# Altium schematic sheet Sheet1.SchDoc
size A
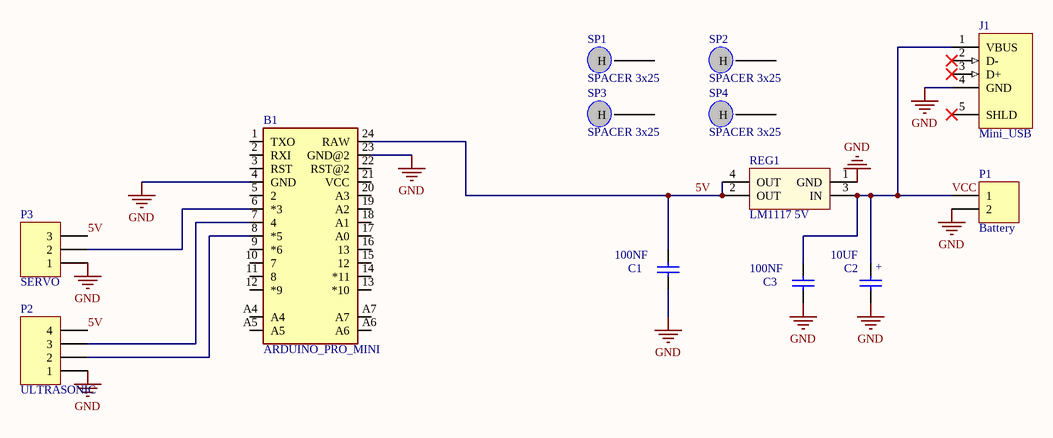
[diagram p0: Sheet1.SchDoc]

## Parts
B1  ARDUINO_PRO_MINI  [ARDUINO_PRO_MINI]
C1  100NF  [MY_CAP_CERAMIC]
C2  10UF  [MY_CAP_POL 4MM]
C3  100NF  [MY_CAP_CERAMIC]
J1  Mini_USB  [My_USB]
P1  Battery  [My_1X02]
P2  ULTRASONIC  [My_1X04]
P3  SERVO  [My_1X03]
REG1  LM1117 5V  [MY_LD1117-3.3]
SP1  SPACER 3x25  [MY_SPACER 3X25MM]
SP2  SPACER 3x25  [MY_SPACER 3X25MM]
SP3  SPACER 3x25  [MY_SPACER 3X25MM]
SP4  SPACER 3x25  [MY_SPACER 3X25MM]

## Nets
GND: B1.4(GND) B1.23(GND@2) C1.1 C2.- C3.1 J1.4(GND) P1.2 P2.1 P3.1 REG1.1(GND)
5V: B1.24(RAW) C1.2 P2.4 P3.3 REG1.2(OUT) REG1.4(OUT)
VCC: C2.+ C3.2 J1.1(VBUS) P1.1 REG1.3(IN)
NetB1_6: B1.6(*3) P3.2
NetB1_7: B1.7(4) P2.3
NetB1_8: B1.8(*5) P2.2

Not connected (* = marked no-connect by the designer): B1 1(TXO) 2(RXI) 3(RST) 5(2) 9(*6) 10(7) 11(8) 12(*9) 13(*10) 14(*11) 15(12) 16(13) 17(A0) 18(A1) 19(A2) 20(A3) 21(VCC) 22(RST@2) A4 A5 A6 A7; J1 2(D-)* 3(D+)* 5(SHLD)*; SP1 0(H); SP2 0(H); SP3 0(H); SP4 0(H)

## Library data of the parts
B1 = ARDUINO_PRO_MINI: ATmega328 Arduino Pro Mini 328 5V/16MHz AVRÂ® ATmega AVR MCU 8-Bit Embedded Evaluation Board; MF: SparkFun Electronics; Availability: Unavailable; Package: Package Analog Devices; SnapEDA_Link: https://www.snapeda.com/parts/ARDUINO%20PRO%20MINI/SparkFun%20Electronics/view-part/2828730/?ref=snap; MP: ARDUINO PRO MINI; Price: None; Value: *
C1 C3 = Cap ceramic: CAP-100Nf; Value: 100nF
C2 = Cap Pol_4mm: CAP-3300Uf; Value: 3300u
J1 = Mini_USB: USB 2.0, Right Angle, SMT, B Type, Receptacle, 5 Position, Black; ContactMaterial: Copper Alloy; ContactPlating: Gold (30); PCB_Layout: Complies with manufacturer's recommendation.; DrillSize: Corresponds to nominal value.; PanelGround: Without; Published: 15-Jul-2004; DatasheetDocument: 27-Jun-2003; PackageDocument: 27-Jun-2003; PackageReference: 440247; Publisher: Altium Limited; HousingMaterial: Thermoplastic; ComponentLink1Description: Manufacturer Link; ComponentLink1URL: http://www.tycoelectronics.com/; ComponentLink2Description: Packaging Specification; ComponentLink2URL: http://ecommas.tycoelectronics.com/commerce/DocumentDelivery/DDEController?Action=showdoc&DocId=Customer+Drawing%7F440247%7FD%7Fpdf%7FEnglish%7FC_440247_D.pdf
P1 = Header 2: Header, 2-Pin; LatestRevisionDate: 17-Jul-2002; LatestRevisionNote: Re-released for DXP Platform.; Publisher: Altium Limited
P2 = Header 4: Header, 4-Pin; LatestRevisionDate: 17-Jul-2002; LatestRevisionNote: Re-released for DXP Platform.; Publisher: Altium Limited
P3 = Header 3: Header, 3-Pin; LatestRevisionDate: 17-Jul-2002; LatestRevisionNote: Re-released for DXP Platform.; Publisher: Altium Limited
REG1 = LD1117 3.3
SP1-SP4 = SPACER 3x25: SACER 3MM